# Altium schematic sheet Power.SchDoc
size A4
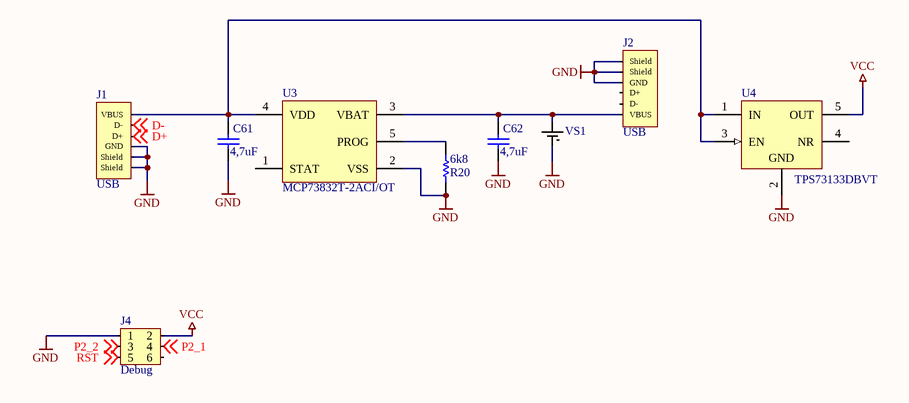
[diagram p0: Power.SchDoc]

## Parts
C61  4,7uF  [CAPC0402(1005)60_L]
C62  4,7uF  [CAPC0402(1005)60_L]
J1  USB  [USB]
J2  USB  [USB]
J4  Debug  [DEBUG]
R20  6k8  [RESC0402(1005)_M]
U3  MCP73832T-2ACI/OT  [SOT-23-OT5_M]
U4  TPS73133DBVT  [TI-DBV5_M]
VS1  Battery  [Misscelaneous con]  (value not drawn)

## Nets
GND: C61.2 C62.2 J1.3(GND) J1.4(Shield) J1.5(Shield) J2.3(GND) J2.4(Shield) J2.5(Shield) J4.1 R20.1 U3.2(VSS) U4.2(GND) VS1.1(-)
VCC: J4.2 U4.5(OUT)
D+: J1.2(D+) ; off-sheet D+
D-: J1.1(D-) ; off-sheet D-
P2_1: J4.4 ; off-sheet P2_1
P2_2: J4.3 ; off-sheet P2_2
RST: J4.5 ; off-sheet RST
NetC61_1: C61.1 J1.0(VBUS) U3.4(VDD) U4.1(IN) U4.3(EN)
NetC62_1: C62.1 J2.0(VBUS) U3.3(VBAT) VS1.0(+)
NetR20_2: R20.2 U3.5(PROG)

Not connected (* = marked no-connect by the designer): J2 1(D-) 2(D+); J4 6; U3 1(STAT); U4 4(NR)

## Library data of the parts
C61 C62 = CMP-1034-00698-1: CAP 10pF 10V ±0.25pF 0402 (1005 Metric) Thickness 0.6mm SMD; Case-Metric: 1005; Case-EIA: 0402; Rated Voltage: 10 V; Value: 4,7uF; Max Thickness: 0.6 mm; Tolerance: ±0.25pF; Technology: SMT
R20 = CMP-1011-00094-1: 6K8 0.063W 5% 0402 (1005 Metric)  SMD; Case-EIA: 0402; Case-Metric: 1005; Power: 0.063 W; Tolerance: 5 %; Value: 6k8; Technology: SMT
U3 = CMP-0133-00138-1: Miniature Single-Cell, Fully Integrated Li-Ion, Li-Polymer Charge Management Controller, 4.2V, 5-Pin SOT-23, Industrial Temperature, Tape and Reel; PackageDescription: 5-Lead Plastic Small Outline Transistor (OT) [SOT-23]; DatasheetVersion: revE, Sep-2008; PackageReference: SOT-23-OT5; PackageVersion: revBB, Aug-2009; Code_IPC: SOT23-5
U4 = CMP-0394-00649-1: Single Output Fast Transient Response LDO, 150 mA, Fixed 3.3 V Output, 1.7 to 5.5 V Input, 5-pin SOT-23 (DBV), -40 to 85 degC, Green (RoHS & no Sb/Br); Manufacturer: Texas Instruments; SubFamily: Single Channel LDO; Vout Adj(Min)(V): 3.3; Iq(Typ)(mA): 0.4; Accuracy(%): 1; Vdo(Typ)(mV): 30; Vin(Min)(V): 1.7; Vin(Max)(V): 5.5; Iout(Max)(A): 0.15; ComponentLink1URL: http://www.ti.com/; ComponentLink3URL: http://www.ti.com/litv/pdf/mpds018i; Mounting Technology: Surface Mount; PackageReference: DBV5; ComponentLink3Description: Package Specification; PartNumber: TPS73133DBVT; PackageDescription: 5-Pin Plastic Small Outline, Body 1.60 Ã— 2.90 mm, Pitch 0.95 mm; ComponentLink2Description: Datasheet; Fixed Output Options(V): 3.3; Code_JEDEC: MO-178; Eco-Plan: Green (RoHS & no Sb/Br); DatasheetVersion: SBVS034M; Vout Adj(Max)(V): 3.3; ComponentLink2URL: http://www.ti.com/general/docs/lit/getliterature.tsp?genericPartNumber=TPS73133&fileType=pdf; ComponentLink1Description: Manufacturer URL; PackageVersion: 4073253-4/K